# Altium schematic sheet NodeMCU_IR_V1.0.SchDoc
size A4
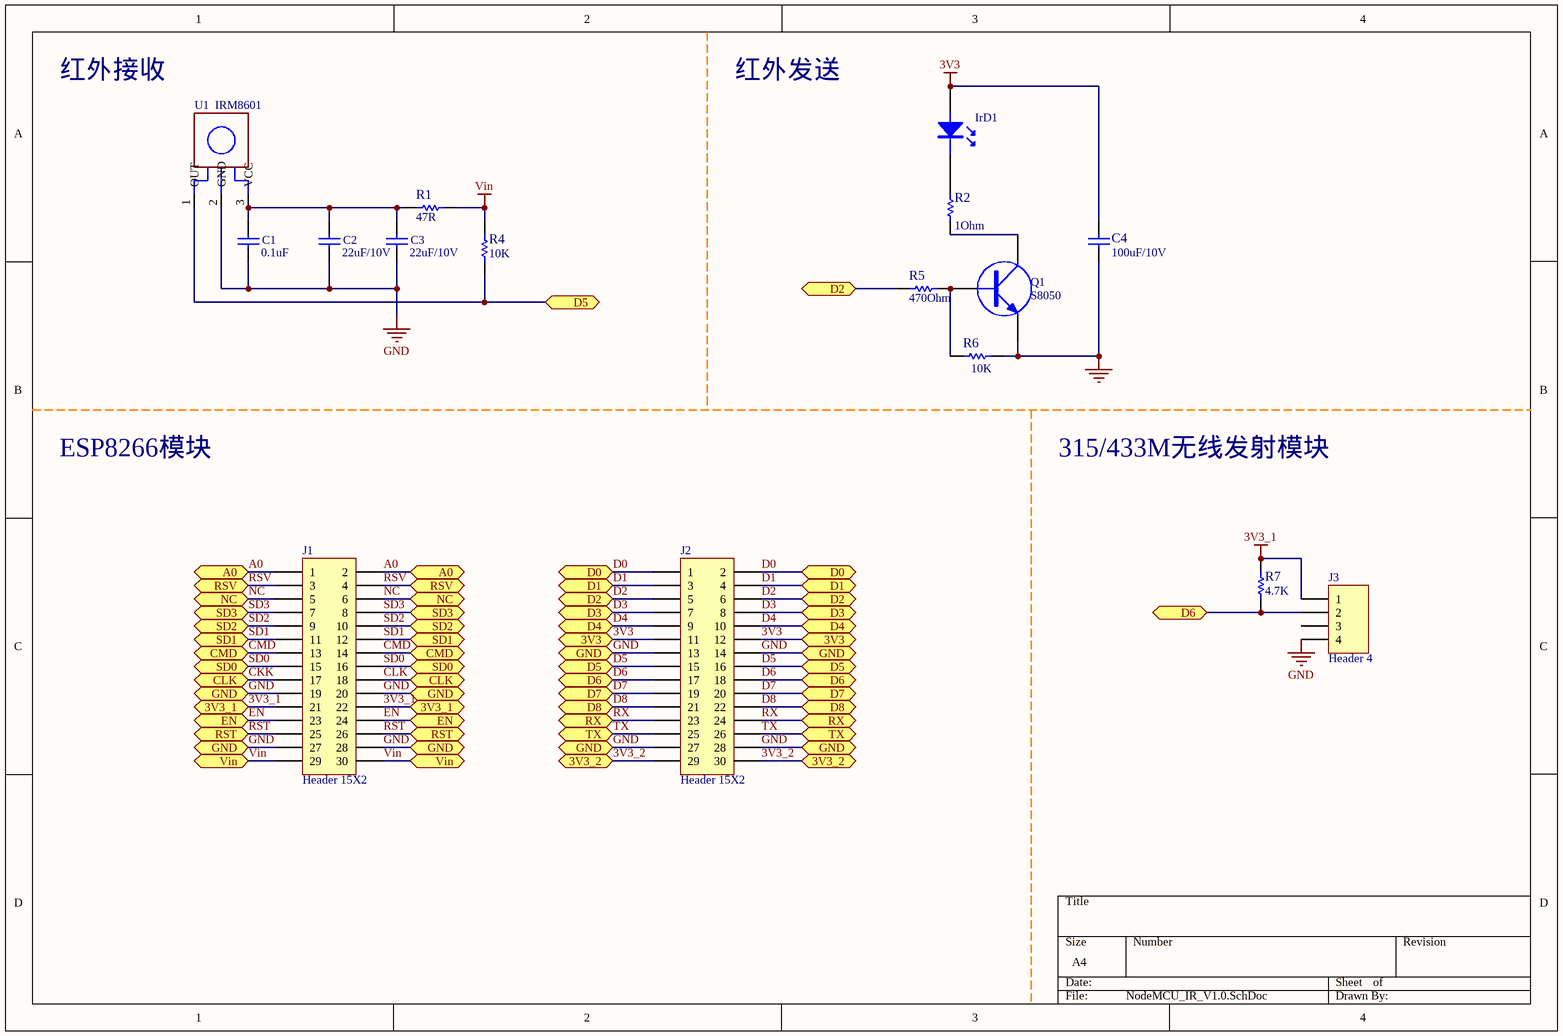
[diagram p0: NodeMCU_IR_V1.0.SchDoc]

## Parts
C1  0.1uF  [0805_C]
C2  22uF/10V  [1206_C]
C3  22uF/10V  [1206_C]
C4  value 100uF/10V  [1206_C]  (hidden comment: ceramic capacitors)
IrD1  (no value)  [LED-0]
J1  Header 15X2  [HDR2X15]
J2  Header 15X2  [HDR2X15]
J3  Header 4  [DHT11]
Q1  S8050  [SOT-SOT23]
R1  47R  [0805R]
R2  1Ohm  [0805R]
R4  10K  [0805R]
R5  470Ohm  [0805R]
R6  10K  [0805R]
R7  4.7K  [0805R]
U1  IRM8601  [LED_IR]

## Ports
3V3, 3V3_1, 3V3_2, A0, CLK, CMD, D0, D1, D2, D3, D4, D5, D6, D7, D8, EN, GND, NC, RST, RSV, RX, SD0, SD1, SD2, SD3, TX, Vin

## Nets
3V3: C4.1 IrD1.A J2.11 J2.12 ; port 3V3
3V3_1: J1.21 J1.22 J3.1 R7.1 ; port 3V3_1
GND: C1.1 C2.1 C3.1 C4.2 J1.19 J1.20 J1.27 J1.28 J2.13 J2.14 J2.27 J2.28 J3.4 Q1.E R6.1 U1.2(GND) ; port GND
Vin: J1.29 J1.30 R1.1 R4.1 ; port Vin
3V3_2: J2.29 J2.30 ; port 3V3_2
A0: J1.1 J1.2 ; port A0
CKK: J1.17 J1.18 ; port CLK  [also labelled CLK]
CMD: J1.13 J1.14 ; port CMD
D0: J2.1 J2.2 ; port D0
D1: J2.3 J2.4 ; port D1
D2: J2.5 J2.6 R5.2 ; port D2
D3: J2.7 J2.8 ; port D3
D4: J2.9 J2.10 ; port D4
D5: J2.15 J2.16 R4.2 U1.1(OUT) ; port D5
D6: J2.17 J2.18 J3.2 R7.2 ; port D6
D7: J2.19 J2.20 ; port D7
D8: J2.21 J2.22 ; port D8
EN: J1.23 J1.24 ; port EN
NC: J1.5 J1.6 ; port NC
RST: J1.25 J1.26 ; port RST
RSV: J1.3 J1.4 ; port RSV
RX: J2.23 J2.24 ; port RX
SD0: J1.15 J1.16 ; port SD0
SD1: J1.11 J1.12 ; port SD1
SD2: J1.9 J1.10 ; port SD2
SD3: J1.7 J1.8 ; port SD3
TX: J2.25 J2.26 ; port TX
NetC1_2: C1.2 C2.2 C3.2 R1.2 U1.3(VCC)
NetIrD1_K: IrD1.K R2.2
NetQ1_B: Q1.B R5.1 R6.2
NetQ1_C: Q1.C R2.1

Not connected (* = marked no-connect by the designer): J3 3

## Notes on the sheet
- 红外接收
- 红外发送
- ESP8266模块
- 315/433M无线发射模块

## Library data of the parts
C1 = Cap Semi: Capacitor (Semiconductor SIM Model); Published: 8-Jun-2000; LatestRevisionDate: 29-May-2009; LatestRevisionNote: IPC-7351 Footprint Added.; PackageReference: C1206; Publisher: Altium Limited; PackageDescription: Chip Capacitor; Value: 0.1uF
C2 C3 = Cap Semi: Capacitor (Semiconductor SIM Model); Value: 0.1uF; Published: 8-Jun-2000; LatestRevisionDate: 29-May-2009; LatestRevisionNote: IPC-7351 Footprint Added.; PackageReference: C1206; Publisher: Altium Limited; PackageDescription: Chip Capacitor
IrD1 = LED
J1 J2 = Header 15X2: Header, 15-Pin, Dual row; LatestRevisionDate: 17-Jul-2002; LatestRevisionNote: Re-released for DXP Platform.; Publisher: Altium Limited
J3 = Header 4: Header, 4-Pin; LatestRevisionDate: 17-Jul-2002; LatestRevisionNote: Re-released for DXP Platform.; Publisher: Altium Limited
Q1 = NPN: NPN Transistor
R1 R2 R4-R7 = Res1: Resistor; Published: 8-Jun-2000; LatestRevisionDate: 17-Jul-2002; LatestRevisionNote: Re-released for DXP Platform.; PackageReference: AXIAL-0.3; Publisher: Altium Limited; PackageDescription: Axial Device, Thru-Hole; 2 Leads; 0.3 in Pin Spacing
  R1: Value: 47R
  R2: Value: 1Ohm
  R4 R6: Value: 10K
  R5: Value: 470Ohm
  R7: Value: 4.7K
U1 = IR-RCV
C4 = ceramic capacitors: Published: 8-Jun-2000; LatestRevisionDate: 29-May-2009; LatestRevisionNote: IPC-7351 Footprint Added.; PackageReference: C1206; Publisher: Altium Limited; PackageDescription: Chip Capacitor